# EAGLE design main (EAGLE 9.6.2)
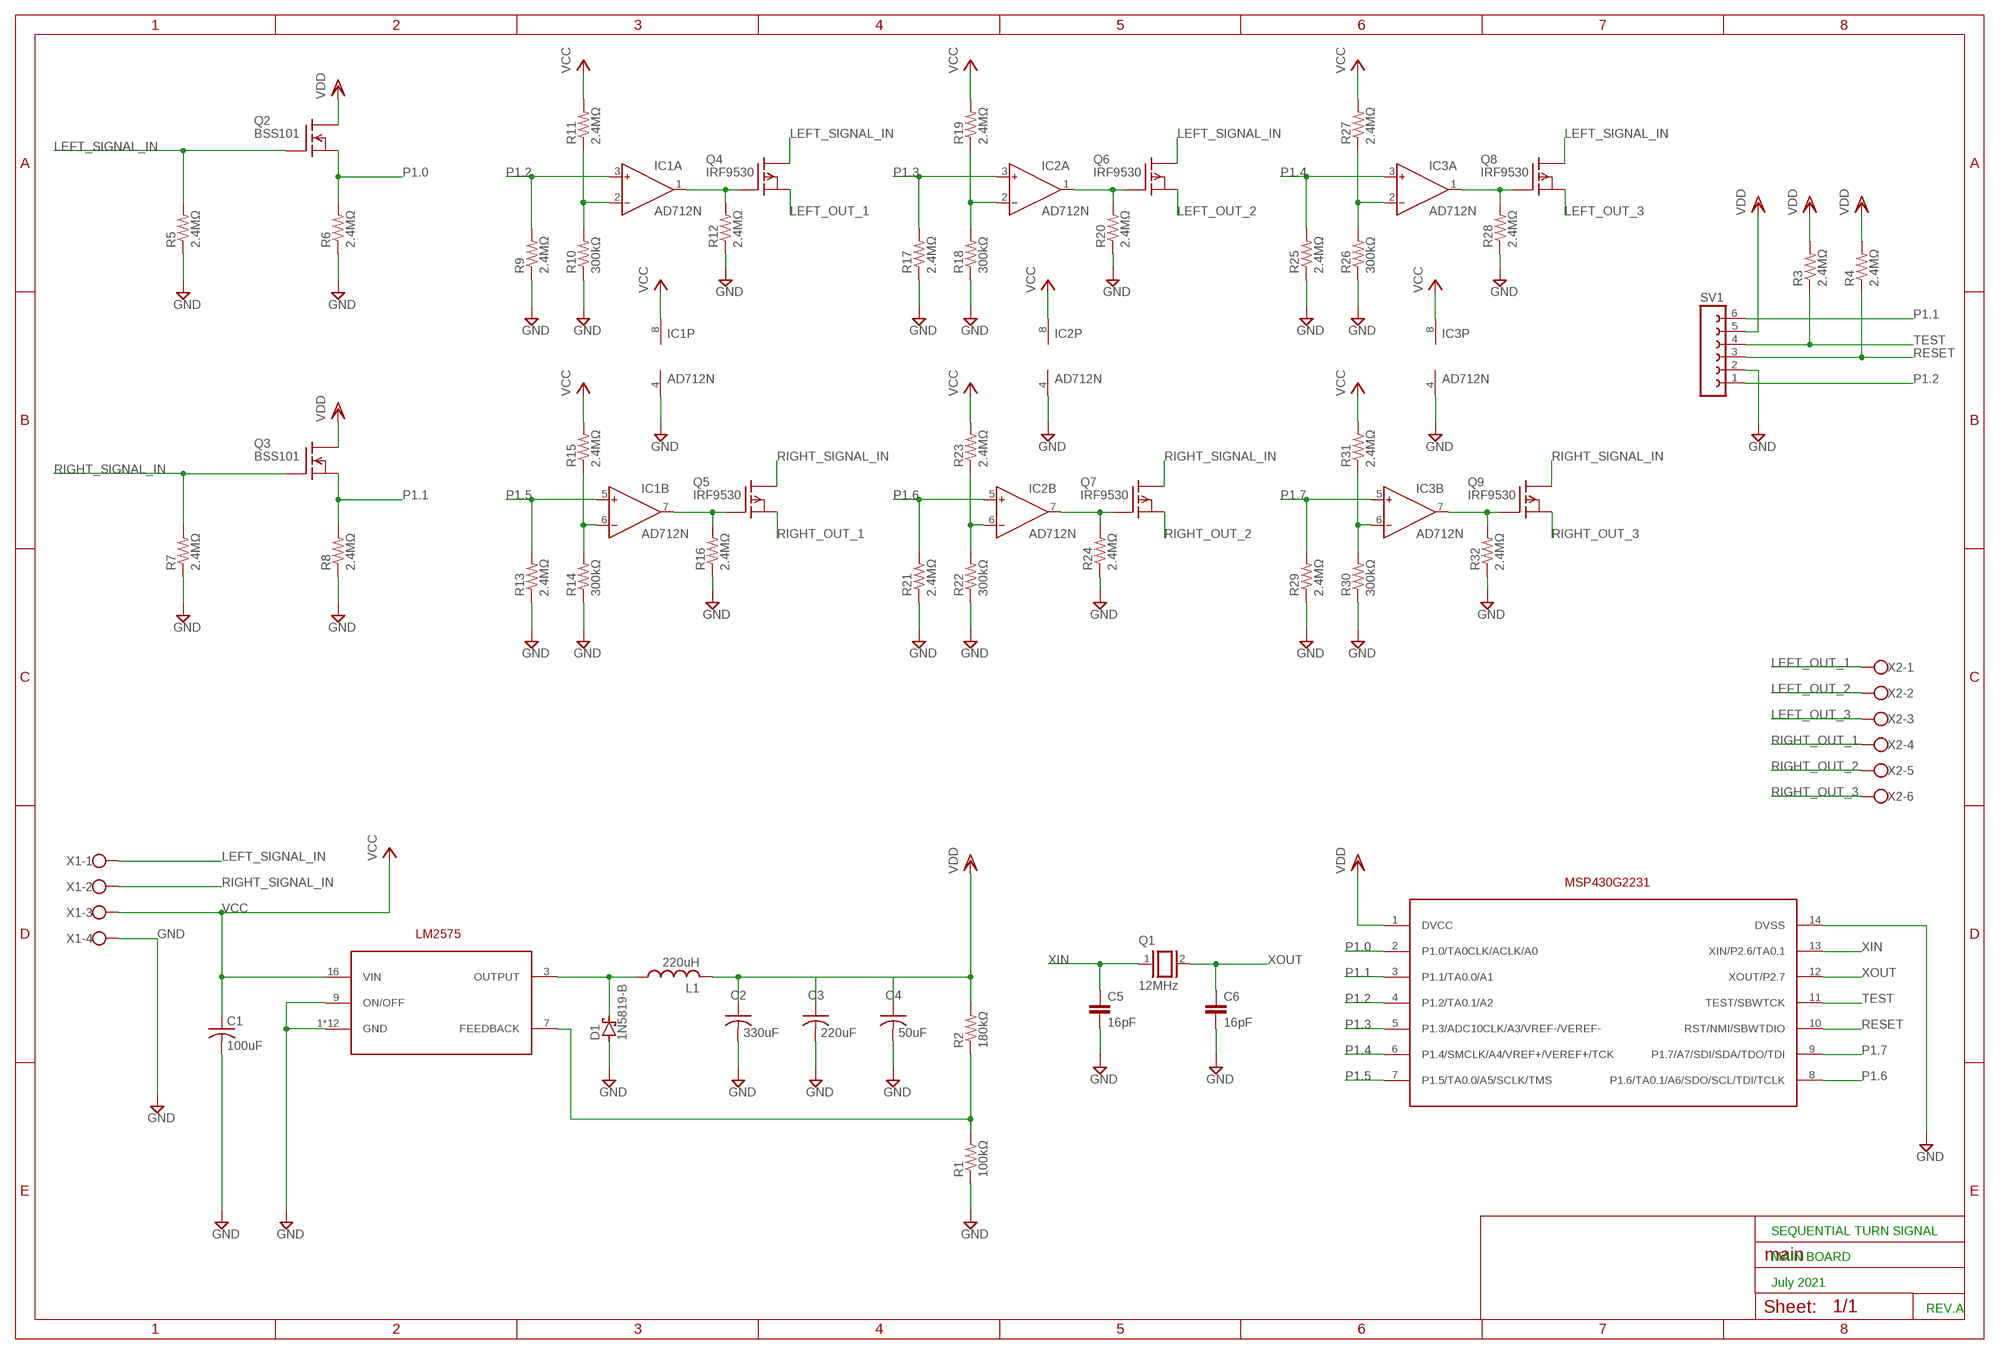
[diagram p0: schematic, sheet 1]

## Parts
C1  100uF  C-US025-050X050  [C025-050X050]
C2  330uF  C-US025-050X050  [C025-050X050]
C3  220uF  C-US025-050X050  [C025-050X050]
C4  50uF  C-US025-050X050  [C025-050X050]
C5  16pF  C-EU025-024X044  [C025-024X044]
C6  16pF  C-EU025-024X044  [C025-024X044]
D1  1N5819-B  [DO41-7.6]
IC1  AD712N  [DIL08]
IC2  AD712N  [DIL08]
IC3  AD712N  [DIL08]
L1  220uH  L-US6000-XXX-RC  [6000-XXXX-RC]
Q1  12MHz  XTAL  [Q]
Q2  BSS101  [TO92]
Q3  BSS101  [TO92]
Q4  IRF9530  [TO220]
Q5  IRF9530  [TO220]
Q6  IRF9530  [TO220]
Q7  IRF9530  [TO220]
Q8  IRF9530  [TO220]
Q9  IRF9530  [TO220]
R1  100kΩ  R-US_0207/12  [0207/12]
R2  180kΩ  R-US_0207/12  [0207/12]
R3  2.4MΩ  R-US_0207/12  [0207/12]
R4  2.4MΩ  R-US_0207/12  [0207/12]
R5  2.4MΩ  R-US_0207/12  [0207/12]
R6  2.4MΩ  R-US_0207/12  [0207/12]
R7  2.4MΩ  R-US_0207/12  [0207/12]
R8  2.4MΩ  R-US_0207/12  [0207/12]
R9  2.4MΩ  R-US_0207/12  [0207/12]
R10  300kΩ  R-US_0207/12  [0207/12]
R11  2.4MΩ  R-US_0207/12  [0207/12]
R12  2.4MΩ  R-US_0207/12  [0207/12]
R13  2.4MΩ  R-US_0207/12  [0207/12]
R14  300kΩ  R-US_0207/12  [0207/12]
R15  2.4MΩ  R-US_0207/12  [0207/12]
R16  2.4MΩ  R-US_0207/12  [0207/12]
R17  2.4MΩ  R-US_0207/12  [0207/12]
R18  300kΩ  R-US_0207/12  [0207/12]
R19  2.4MΩ  R-US_0207/12  [0207/12]
R20  2.4MΩ  R-US_0207/12  [0207/12]
R21  2.4MΩ  R-US_0207/12  [0207/12]
R22  300kΩ  R-US_0207/12  [0207/12]
R23  2.4MΩ  R-US_0207/12  [0207/12]
R24  2.4MΩ  R-US_0207/12  [0207/12]
R25  2.4MΩ  R-US_0207/12  [0207/12]
R26  300kΩ  R-US_0207/12  [0207/12]
R27  2.4MΩ  R-US_0207/12  [0207/12]
R28  2.4MΩ  R-US_0207/12  [0207/12]
R29  2.4MΩ  R-US_0207/12  [0207/12]
R30  300kΩ  R-US_0207/12  [0207/12]
R31  2.4MΩ  R-US_0207/12  [0207/12]
R32  2.4MΩ  R-US_0207/12  [0207/12]
SV1  FE06-1  [FE06]
U$1  MSP430G2231PDIP14  [DIP762W53P254L1969H508Q14B]
U$2  LM2575PDIP16  [DIP762W53P254L1969H508Q16B]
X1  W237-4  [W237-4]
X2  W237-6  [W237-6]

## Nets
GND: C1.2 C2.2 C3.2 C4.2 C5.2 C6.2 D1.A IC1.4(P:V-) IC2.4(P:V-) IC3.4(P:V-) R1.1 R5.1 R6.1 R7.1 R8.1 R9.1 R10.1 R12.1 R13.1 R14.1 R16.1 R17.1 R18.1 R20.1 R21.1 R22.1 R24.1 R25.1 R26.1 R28.1 R29.1 R30.1 R32.1 SV1.2 U$1.14(DVSS) U$2.1(GND) U$2.2(GND) U$2.4(GND) U$2.5(GND) U$2.6(GND) U$2.8(GND) U$2.9(ON/OFF) U$2.10(GND) U$2.11(GND) U$2.12(GND) U$2.13(GND) U$2.14(GND) U$2.15(GND) X1.4
LEFT_OUT_1: Q4.3(S) X2.1
LEFT_OUT_2: Q6.3(S) X2.2
LEFT_OUT_3: Q8.3(S) X2.3
LEFT_SIGNAL_IN: Q2.2(G) Q4.2(D) Q6.2(D) Q8.2(D) R5.2 X1.1
N$1: D1.C L1.1 U$2.3(OUTPUT)
N$3: R1.2 R2.1 U$2.7(FEEDBACK)
N$8: IC1.6(B:IN-) R14.2 R15.1
N$10: IC1.7(B:OUT) Q5.1(G) R16.2
N$11: IC1.1(A:OUT) Q4.1(G) R12.2
N$14: IC1.2(A:IN-) R10.2 R11.1
N$18: IC2.6(B:IN-) R22.2 R23.1
N$20: IC2.7(B:OUT) Q7.1(G) R24.2
N$21: IC2.1(A:OUT) Q6.1(G) R20.2
N$24: IC2.2(A:IN-) R18.2 R19.1
N$28: IC3.6(B:IN-) R30.2 R31.1
N$30: IC3.7(B:OUT) Q9.1(G) R32.2
N$31: IC3.1(A:OUT) Q8.1(G) R28.2
N$34: IC3.2(A:IN-) R26.2 R27.1
P1.0: Q2.1(S) R6.2 U$1.2(P1.0/TA0CLK/ACLK/A0)
P1.1: Q3.1(S) R8.2 SV1.6 U$1.3(P1.1/TA0.0/A1)
P1.2: IC1.3(A:IN+) R9.2 SV1.1 U$1.4(P1.2/TA0.1/A2)
P1.3: IC2.3(A:IN+) R17.2 U$1.5(P1.3/ADC10CLK/A3/VREF-/VEREF-)
P1.4: IC3.3(A:IN+) R25.2 U$1.6(P1.4/SMCLK/A4/VREF+/VEREF+/TCK)
P1.5: IC1.5(B:IN+) R13.2 U$1.7(P1.5/TA0.0/A5/SCLK/TMS)
P1.6: IC2.5(B:IN+) R21.2 U$1.8(P1.6/TA0.1/A6/SDO/SCL/TDI/TCLK)
P1.7: IC3.5(B:IN+) R29.2 U$1.9(P1.7/A7/SDI/SDA/TDO/TDI)
RESET: R4.1 SV1.3 U$1.10(RST/NMI/SBWTDIO)
RIGHT_OUT_1: Q5.3(S) X2.4
RIGHT_OUT_2: Q7.3(S) X2.5
RIGHT_OUT_3: Q9.3(S) X2.6
RIGHT_SIGNAL_IN: Q3.2(G) Q5.2(D) Q7.2(D) Q9.2(D) R7.2 X1.2
TEST: R3.1 SV1.4 U$1.11(TEST/SBWTCK)
VCC: C1.1 IC1.8(P:V+) IC2.8(P:V+) IC3.8(P:V+) R11.2 R15.2 R19.2 R23.2 R27.2 R31.2 U$2.16(VIN) X1.3
VDD: C2.1 L1.2 Q2.3(D) Q3.3(D) R2.2 R3.2 R4.2 SV1.5 U$1.1(DVCC)
VDD1: C3.1
VDD2: C4.1
XIN: C5.1 Q1.1 U$1.13(XIN/P2.6/TA0.1)
XOUT: C6.1 Q1.2 U$1.12(XOUT/P2.7)

## Notes on the sheet
- SEQUENTIAL TURN SIGNAL
- MAIN BOARD
- July 2021
- REV.A

## Library data of the parts
C1-C4 = rcl:C-US: CAPACITOR, American symbol; SPICEPREFIX: C
C5 C6 = rcl:C-EU: CAPACITOR, European symbol; SPICEPREFIX: C
D1 = diode:1N581*: 1.0A SCHOTTKY BARRIER RECTIFIER Source: http://www.diodes.com/datasheets/ds23001.pdf
IC1-IC3 = analog-devices:AD712: Dual Precision, Low Cost, High Speed BiFET Op Amp Source: http://www.analog.com/static/imported-files/data_sheets/AD712.pdf; MF: ALTERA CORPORATION; MPN: AD712JNZ; OC_FARNELL: 9604898; OC_NEWARK: 59K4554
L1 = rcl:L-US: INDUCTOR, American symbol; SPICEPREFIX: L
Q1 = special:XTAL: CRYSTAL
Q2 Q3 = transistor-fet:BSS101: N-Channel Enhancement MOSFET 200V; 0,16A; 11Ohm
Q4-Q9 = transistor-fet:IRF9530: P-Channel Enhancement MOSFET (HEXFET); -100V; -12A; 0,3Ohm
R1-R32 = rcl:R-US_: RESISTOR, American symbol; SPICEPREFIX: R
SV1 = con-lsta:FE06-1: FEMALE HEADER; OC_FARNELL: unknown; OC_NEWARK: unknown
U$1 = sequential_turn_signal:MSP430G2231: The Texas Instruments MSP430 family of ultra-low-power microcontrollers consists of several devices featuring different sets of peripherals targeted for various applications. The architecture, combined with five low-power modes, is optimized to achieve extended battery life in portable measurement applications. The device features a powerful 16-bit RISC CPU, 16-bit registers, and constant generators that contribute to maximum code efficiency. The digitally controlled oscillator (DCO) allows wake-up from low-power modes to active mode in less than 1 µs. The MSP430G2x21/G2x31 series is an ultra-low-power mixed signal microcontroller with a built-in 16-bit timer and ten I/O pins. The MSP430G2x31 family members have a 10-bit A/D converter and built-in communication capability using synchronous protocols (SPI or I2C). Typical applications include low-cost sensor systems that capture analog signals, convert them to digital values, and then process the data for display or for transmission to a host system.
U$2 = sequential_turn_signal:LM2575: The LM2575 device greatly simplifies the design of switching power supplies by conveniently providing all the active functions needed for a step-down (buck) switching regulator in an integrated circuit. Accepting a wide input voltage range and available in an adjustable output version, the LM2575 has an integrated switch capable of delivering 1 A of load current, with excellent line and load regulation. The device also offers internal frequency compensation, a fixed-frequency oscillator, cycle-by-cycle current limiting, and thermal shutdown. In addition, a manual shutdown is available through an external ON/OFF pin. The LM2575 represents a superior alternative to popular three-terminal linear regulators. Due to its high efficiency, it significantly reduces the size of the heat sink and, in many cases, no heat sink is required. Optimized for use with standard series of inductors available from several different manufacturers, the LM2575 greatly simplifies the design of switch-mode power supplies by requiring a minimal addition of only four to six external components for operation. The LM2575 is characterized for operation over the virtual junction temperature range of –40°C to 125°C.
X1 = con-wago-500:W237-4: WAGO SCREW CLAMP; OC_FARNELL: unknown; OC_NEWARK: unknown
X2 = con-wago-500:W237-6: WAGO SCREW CLAMP; OC_FARNELL: unknown; OC_NEWARK: unknown

## Board
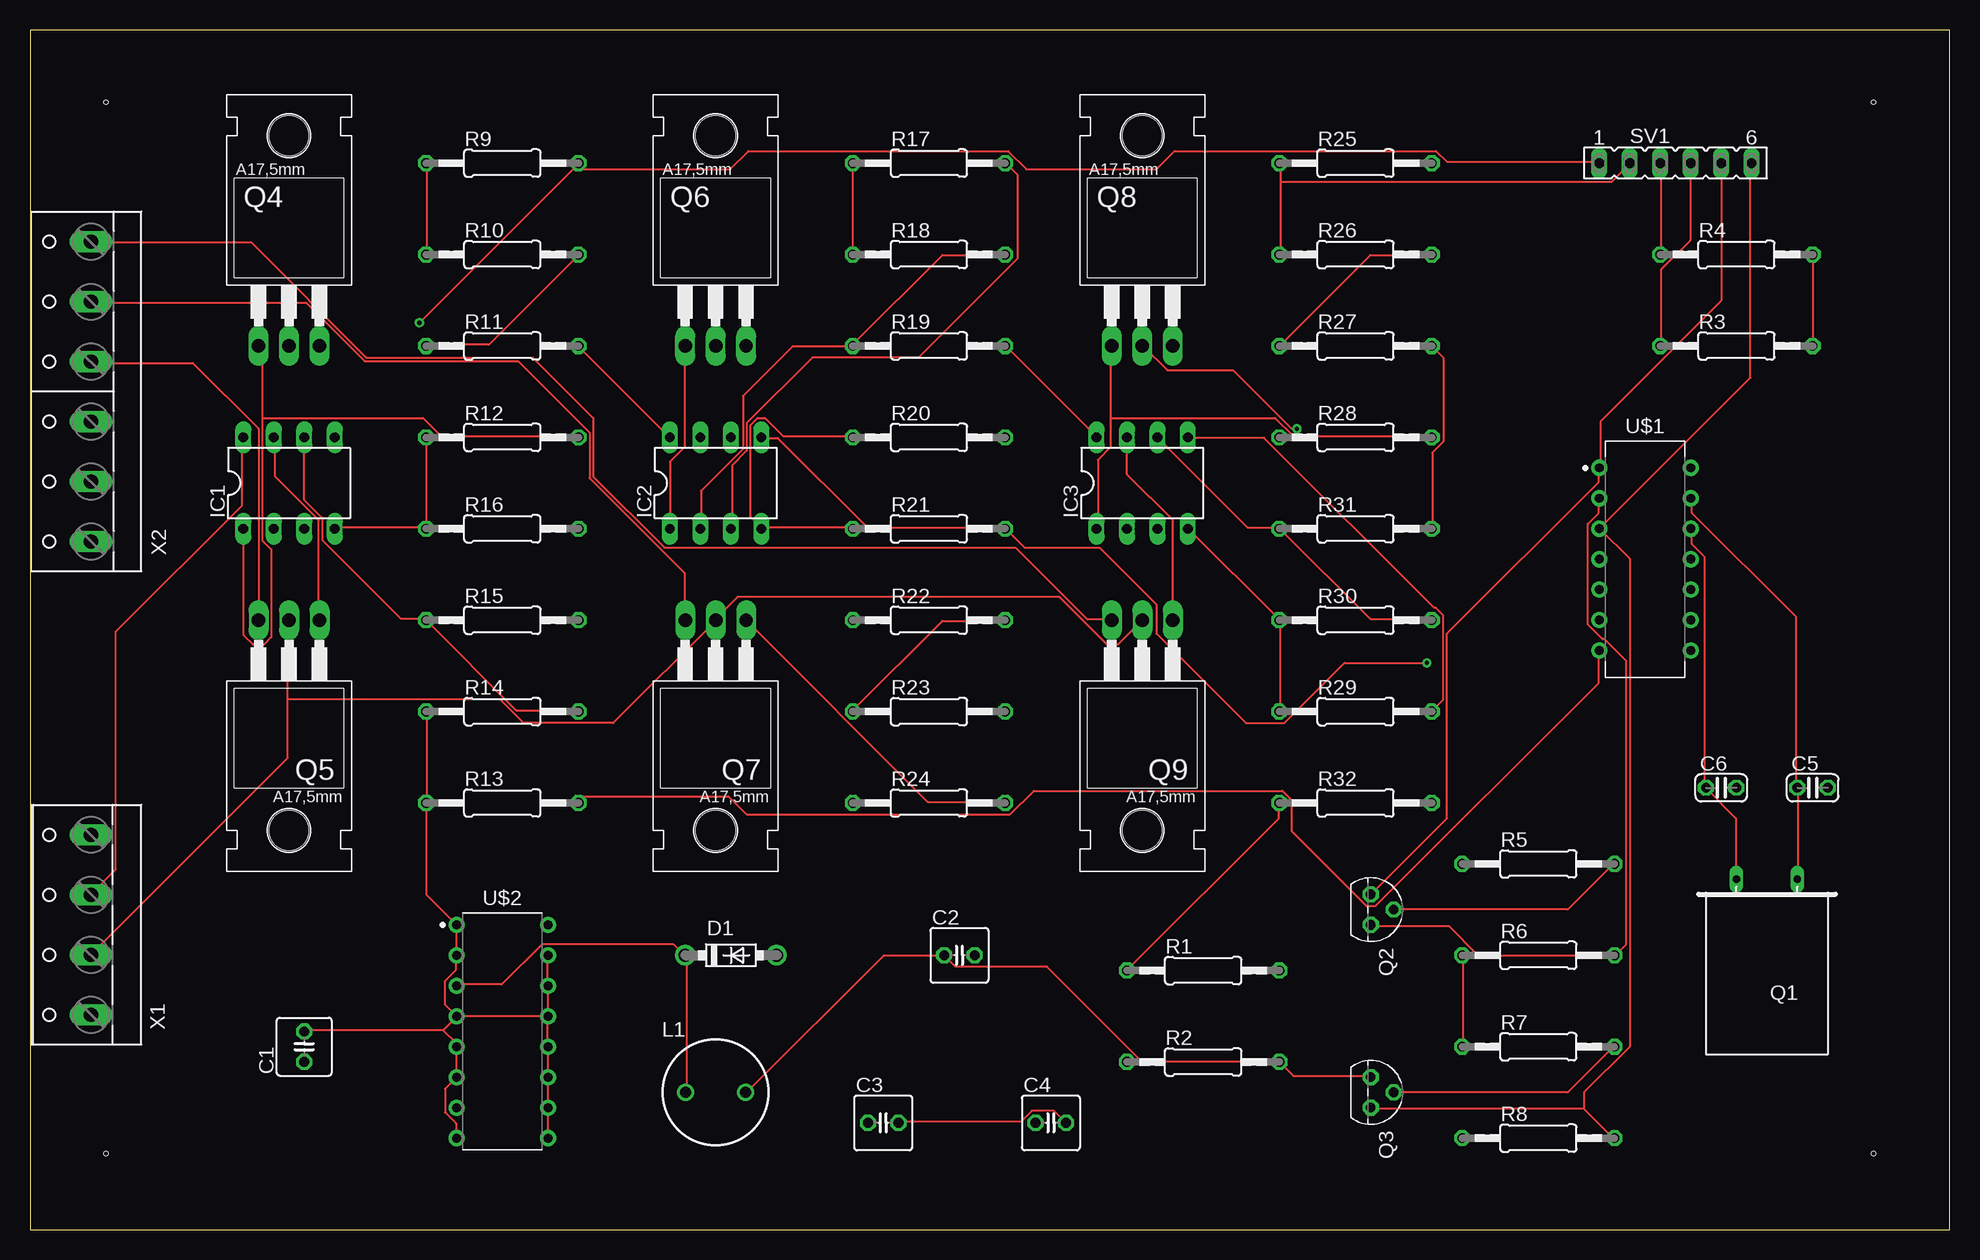
[diagram p1: board, top side]
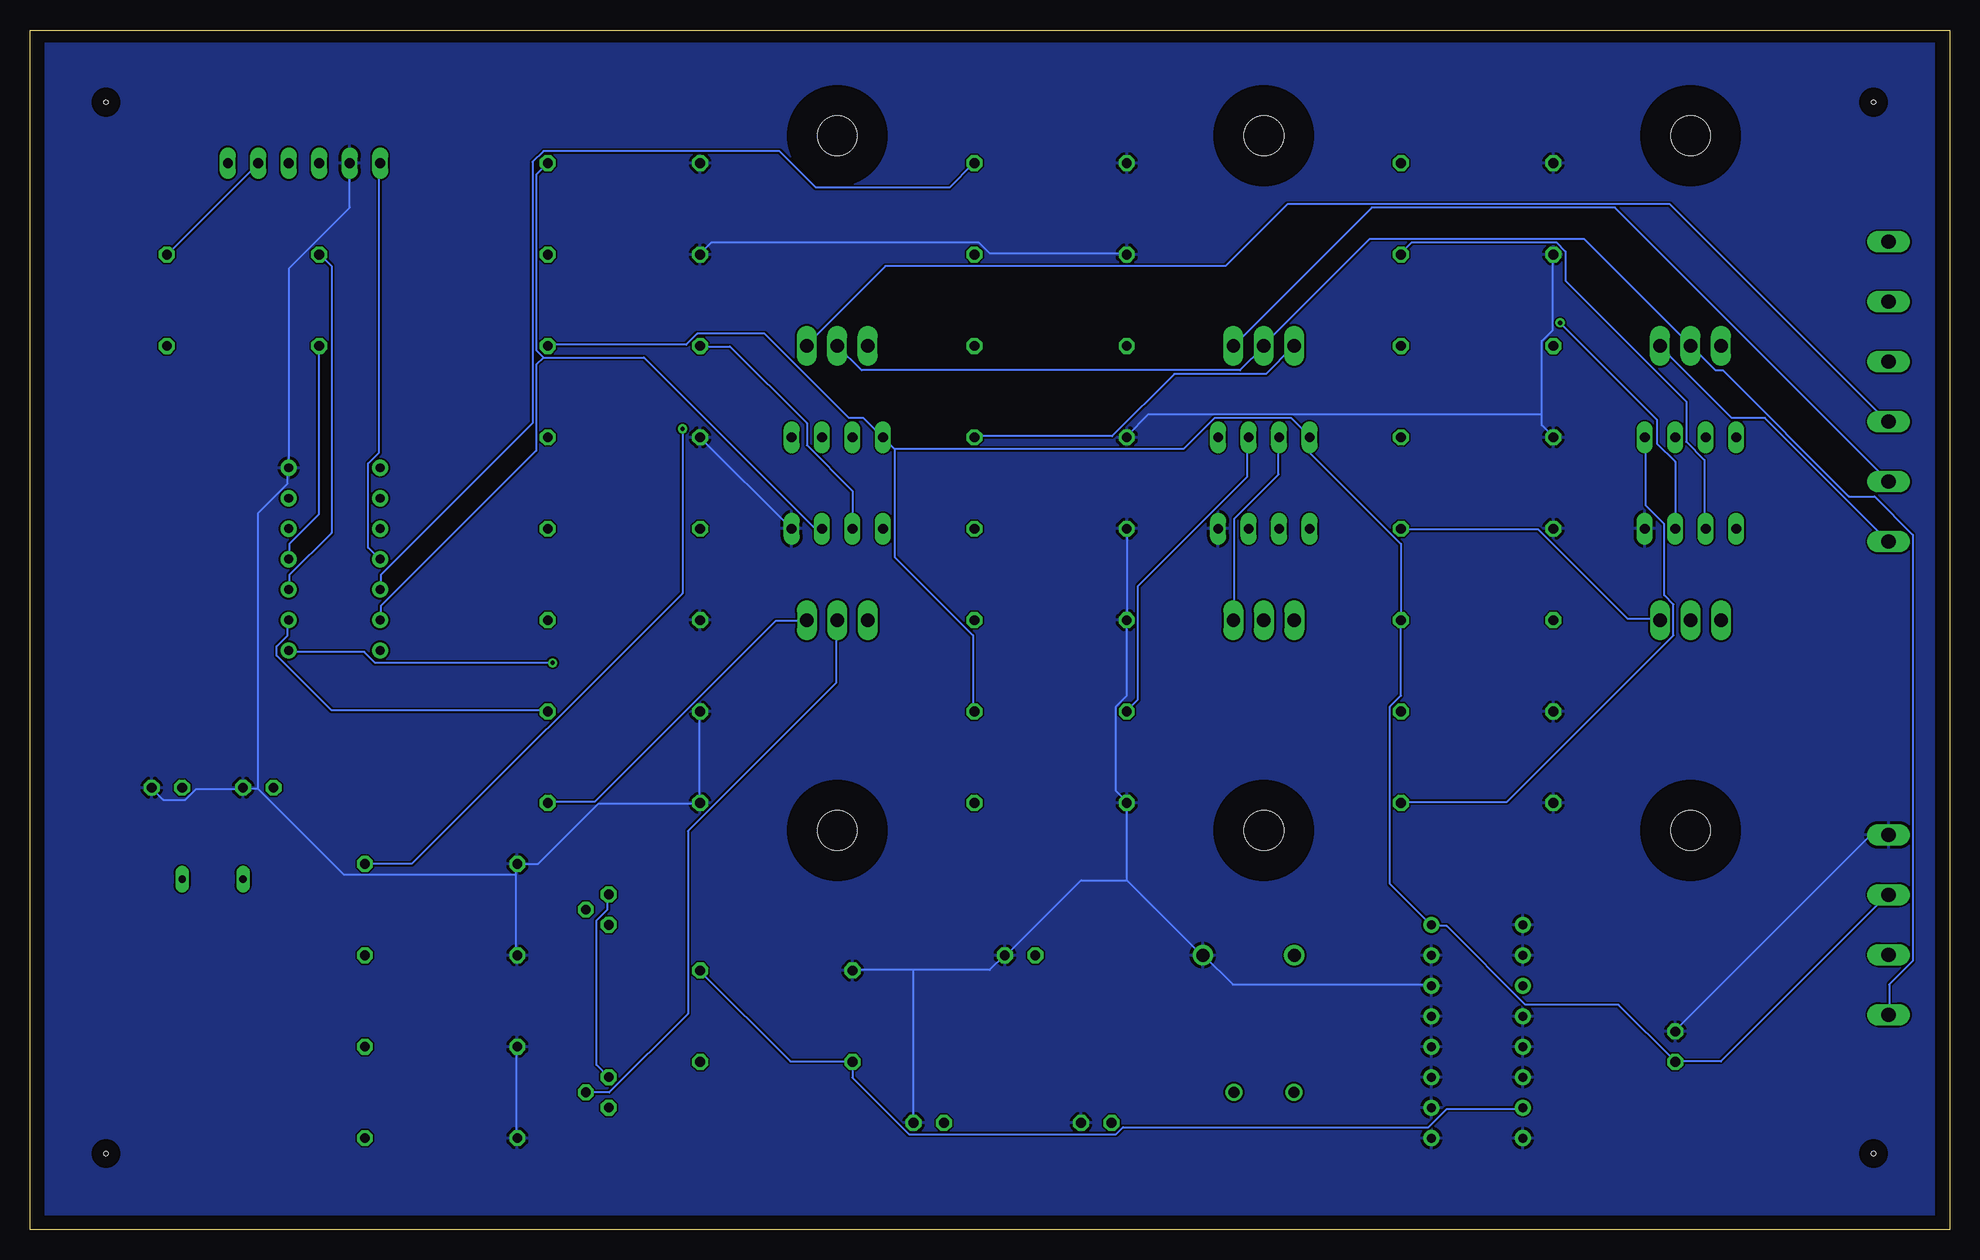
[diagram p2: board, bottom side, seen from below]

Size 160 x 100 mm. Coordinates in mm from the lower left corner, seen from the top.
Outline: 0,0 160,0 160,100 0,100 0,0
Copper layers (1*16): Top 0.035mm / dielectric 1.5mm / Bottom 0.035mm
Design rules "default": minimum track width 6mil, minimum drill 0.35mm, track to track 6mil, track to pad 6mil, pad to pad 6mil, via to via 6mil, smd to smd 6mil, copper to edge 40mil, drill to drill 6mil, minimum pad ring 10mil, minimum via ring 8mil, stop-mask expansion 4mil, vias tented up to drill 0mil, thermal gap 10mil
Holes 0.35 mm at 6.35,93.98 6.35,6.35 153.67,6.35 153.67,93.98

### Footprints (pad centres in the part's own frame; a part is rotated, then mirrored left to right if it is on the bottom)
C025-050X050 = drill 0.813 octagon: 1 -1.27,0; 2 1.27,0
C025-024X044 = drill 0.813 octagon: 1 -1.27,0; 2 1.27,0
DO41-7.6 = drill 1.1 pad 1.7: A 3.81,0; C -3.81,0
DIL08 = drill 0.813 long: 1 -3.81,-3.81; 2 -1.27,-3.81; 3 1.27,-3.81; 4 3.81,-3.81; 5 3.81,3.81; 6 1.27,3.81; 7 -1.27,3.81; 8 -3.81,3.81
6000-XXXX-RC = drill 0.9 pad 1.422: 1 -2.5,0; 2 2.5,0
Q = drill 0.61 long: 1 -2.54,-7.62; 2 2.54,-7.62
TO92 = drill 0.813 octagon: 1 1.27,0; 2 0,1.905; 3 -1.27,0
TO220 = drill 1.118 long: 1 -2.54,-6.35; 2 0,-6.35; 3 2.54,-6.35 | hole 3.302: 0,11.176
0207/12 = drill 0.813 octagon: 1 -6.35,0; 2 6.35,0
FE06 = drill 0.813 long: 1 -6.35,0; 2 -3.81,0; 3 -1.27,0; 4 1.27,0; 5 3.81,0; 6 6.35,0
DIP762W53P254L1969H508Q14B = drill 0.743 pad 1.343: 1 -3.81,7.62; 2 -3.81,5.08; 3 -3.81,2.54; 4 -3.81,0; 5 -3.81,-2.54; 6 -3.81,-5.08; 7 -3.81,-7.62; 8 3.81,-7.62; 9 3.81,-5.08; 10 3.81,-2.54; 11 3.81,0; 12 3.81,2.54; 13 3.81,5.08; 14 3.81,7.62
DIP762W53P254L1969H508Q16B = drill 0.743 pad 1.343: 1 -3.81,8.89; 2 -3.81,6.35; 3 -3.81,3.81; 4 -3.81,1.27; 5 -3.81,-1.27; 6 -3.81,-3.81; 7 -3.81,-6.35; 8 -3.81,-8.89; 9 3.81,-8.89; 10 3.81,-6.35; 11 3.81,-3.81; 12 3.81,-1.27; 13 3.81,1.27; 14 3.81,3.81; 15 3.81,6.35; 16 3.81,8.89
W237-4 = drill 1.194 long: 1 -7.5,-1.27; 2 -2.5,-1.27; 3 2.5,-1.27; 4 7.5,-1.27
W237-6 = drill 1.194 long: 1 -12.5,-1.27; 2 -7.5,-1.27; 3 -2.5,-1.27; 4 2.5,-1.27; 5 7.5,-1.27; 6 12.5,-1.27

### Placement (x,y rotation side)
C1  22.86,15.24 90 top
C2  77.47,22.86 0 top
C3  71.12,8.89 0 top
C4  85.09,8.89 0 top
C5  148.59,36.83 0 top
C6  140.97,36.83 0 top
D1  58.42,22.86 0 top
IC1  21.59,62.23 0 top
IC2  57.15,62.23 0 top
IC3  92.71,62.23 0 top
L1  57.15,11.43 0 top
Q1  144.78,21.59 180 top
Q2  111.76,26.67 270 top
Q3  111.76,11.43 270 top
Q4  21.59,80.01 0 top
Q5  21.59,44.45 180 top
Q6  57.15,80.01 0 top
Q7  57.15,44.45 180 top
Q8  92.71,80.01 0 top
Q9  92.71,44.45 180 top
R1  97.79,21.59 0 top
R2  97.79,13.97 0 top
R3  142.24,73.66 0 top
R4  142.24,81.28 0 top
R5  125.73,30.48 0 top
R6  125.73,22.86 0 top
R7  125.73,15.24 0 top
R8  125.73,7.62 0 top
R9  39.37,88.9 0 top
R10  39.37,81.28 0 top
R11  39.37,73.66 0 top
R12  39.37,66.04 0 top
R13  39.37,35.56 0 top
R14  39.37,43.18 0 top
R15  39.37,50.8 0 top
R16  39.37,58.42 0 top
R17  74.93,88.9 0 top
R18  74.93,81.28 0 top
R19  74.93,73.66 0 top
R20  74.93,66.04 0 top
R21  74.93,58.42 0 top
R22  74.93,50.8 0 top
R23  74.93,43.18 0 top
R24  74.93,35.56 0 top
R25  110.49,88.9 0 top
R26  110.49,81.28 0 top
R27  110.49,73.66 0 top
R28  110.49,66.04 0 top
R29  110.49,43.18 0 top
R30  110.49,50.8 0 top
R31  110.49,58.42 0 top
R32  110.49,35.56 0 top
SV1  137.16,88.9 0 top
U$1  134.62,55.88 0 top
U$2  39.37,16.51 0 top
X1  3.81,25.4 90 top
X2  3.81,69.85 90 top

### Tracks (layer width: path | path; a pad name or v marks a point on that pad's centre or on a via)
GND
  Top 0.152: R17.1 R18.1 | 104.24,87.33 104.24,88.85 R25.1 | 104.24,87.33 104.24,81.38 R26.1 | R29.1 104.24,43.28 104.24,50.75 R30.1 104.09,50.9 96.62,58.37 IC3.4 | R6.1 119.48,22.86 119.48,15.24 R7.1 | 104.24,87.33 131.83,87.33 133.35,88.85 SV1.2 | 43.13,17.83 43.13,20.27 U$2.14 43.13,20.42 43.13,22.86 U$2.15 | U$2.9 43.13,7.62 43.13,10.06 U$2.10 43.13,10.21 43.13,12.65 U$2.11 43.13,12.8 43.13,15.24 | 43.13,15.24 43.13,17.68 U$2.13 43.13,17.83 | 43.13,15.24 U$2.12 | R14.1 33.07,43.13 33.07,35.66 R13.1 33.07,35.51 33.07,27.89 U$2.1 35.51,25.3 35.51,22.86 | U$2.8 35.51,7.62 35.51,8.84 34.59,9.75 34.59,11.73 U$2.6 35.51,12.8 35.51,15.24 | 34.44,16.61 22.86,16.61 C1.2 | 34.44,16.61 35.51,17.68 U$2.4 | 35.51,15.24 35.51,15.54 34.44,16.61 | 35.51,22.86 35.51,21.64 34.59,20.73 34.59,18.75 U$2.4 | 35.51,22.86 U$2.2 | 35.51,15.24 U$2.5 | 43.13,17.83 35.66,17.83 U$2.4 | R10.1 33.07,81.38 33.07,88.85 R9.1 | IC1.4 25.45,58.52 32.92,58.52 R16.1 33.07,58.52 33.07,65.99 R12.1 | 60.96,58.52 68.58,58.52 R21.1 | 60.96,58.52 60.05,59.44 60.05,67.06 60.66,67.67 61.27,67.67 62.79,66.14 68.58,66.14 R20.1 | 60.96,58.52 IC2.4 | C4.2 85.34,9.91 83.52,9.91 82.6,8.99 72.39,8.99 C3.2 | R32.1 104.09,35.51 104.09,34.29 91.44,21.64 R1.1
  Bottom 0.152: R18.1 68.58,81.38 80.01,81.38 80.92,82.3 103.17,82.3 104.09,81.38 R26.1 | R28.1 IC3.4 | R29.1 104.24,43.13 104.24,35.66 R32.1 104.24,35.51 112.62,35.51 117.65,30.48 R5.1 119.48,30.48 119.48,29.57 | SV1.2 133.35,85.19 138.38,80.16 138.38,63.55 U$1.14 138.53,63.4 138.53,62.18 140.97,59.74 140.97,36.73 | C5.2 149.81,36.73 148.9,35.81 147.07,35.81 146.15,36.73 142.34,36.73 C6.2 142.19,36.73 140.97,36.73 | R8.1 119.48,7.62 119.48,15.24 R7.1 | 119.48,29.57 119.48,22.86 R6.1 | 140.97,36.73 133.81,29.57 119.48,29.57 | X1.4 5.18,32.77 6.71,32.77 22.86,16.61 C1.2 | 33.98,67.97 33.98,67.06 33.07,66.14 R12.1 | 33.98,67.97 33.98,74.07 33.07,74.98 33.07,81.23 R10.1 | R21.1 R22.1 68.58,44.5 69.49,43.59 69.49,36.58 68.58,35.66 R24.1 68.58,29.11 | 68.58,29.11 62.33,22.86 D1.A 62.18,22.86 59.74,20.42 43.28,20.42 U$2.14 | 86.41,21.64 80.01,21.64 78.79,22.86 C2.2 78.64,22.86 72.39,29.11 68.58,29.11 | 86.41,21.64 91.44,21.64 R1.1 | 86.41,21.64 86.41,8.99 C4.2 | 33.98,67.97 66.75,67.97 68.58,66.14 R20.1
  pour Bottom: 1.27,99.06 158.75,99.06 158.75,1.27 1.27,1.27
LEFT_OUT_1
  Bottom 0.152: Q4.3 18.14,67.67 15.39,67.67 5.18,57.45 X2.1
LEFT_OUT_2
  Bottom 0.152: Q6.3 48.16,85.19 27.89,85.19 5.18,62.48 X2.2
LEFT_OUT_3
  Bottom 0.152: Q8.3 95.25,73.76 88.7,80.31 60.35,80.31 55.17,85.5 23.32,85.5 5.18,67.36 X2.3
LEFT_SIGNAL_IN  (via drill 0.35)
  Top 0.152: Q2.2 128.17,26.67 131.98,30.48 R5.2 | v105.61,66.75 105.16,66.75 100.28,71.63 94.79,71.63 92.81,73.61 Q8.2
  Bottom 0.152: Q8.2 90.68,71.63 59.13,71.63 57.15,73.61 Q6.2 57.15,73.76 48.31,82.6 30.48,82.6 21.64,73.76 Q4.2 21.49,73.61 19.51,71.63 18.9,71.63 8.38,61.11 6.25,61.11 3.05,57.91 3.05,22.4 5.03,20.42 5.03,17.98 X1.1 | R5.2 128.17,30.48 105.61,53.03 v105.61,66.75
N$1
  Top 0.152: U$2.3 35.66,20.42 39.32,20.42 42.67,23.77 53.65,23.77 54.56,22.86 D1.C 54.71,22.86 54.71,11.43 L1.1
N$3
  Bottom 0.152: R1.2 104.09,21.49 96.62,14.02 91.44,14.02 R2.1 91.44,12.65 86.72,7.92 69.49,7.92 68.89,8.53 43.43,8.53 41.91,10.06 35.66,10.06 U$2.7
N$8
  Top 0.152: R14.2 45.72,43.28 40.54,43.28 R15.1 32.92,50.9 30.94,50.9 24.38,57.45 24.38,59.28 22.86,60.81 IC1.6
N$10
  Top 0.152: IC1.7 20.42,65.99 20.42,62.79 24.08,59.13 24.08,50.9 Q5.1
  Bottom 0.152: R16.2 45.72,58.37 34.29,58.37 26.82,50.9 24.23,50.9 Q5.1
N$11
  Top 0.152: 19.36,67.67 19.36,73.3 19.05,73.61 Q4.1 | 19.36,67.67 19.36,57.45 20.12,56.69 20.12,49.38 19.51,48.77 18.59,48.77 17.83,49.53 17.83,58.37 IC1.1 | 19.36,67.67 32.77,67.67 34.29,66.14 45.72,66.14 R12.2
N$14
  Top 0.152: R11.1 33.07,73.76 38.25,73.76 45.72,81.23 R10.2
  Bottom 0.152: IC1.2 20.42,58.52 20.42,64.16 21.95,65.68 21.95,69.04 32,79.1 32,81.53 32.77,82.3 44.81,82.3 45.72,81.38 R10.2
N$18
  Top 0.152: R22.2 81.23,50.75 76.05,50.75 68.58,43.28 R23.1
  Bottom 0.152: IC2.6 58.52,65.99 58.52,62.79 67.67,53.65 67.67,44.2 68.58,43.28 R23.1
N$20
  Top 0.152: Q7.1 74.83,35.66 81.23,35.66 R24.2
  Bottom 0.152: IC2.7 55.93,65.99 55.93,62.94 59.59,59.28 59.59,50.9 Q7.1
N$21
  Top 0.152: IC2.1 53.34,64.01 54.56,65.23 54.56,73.61 Q6.1
  Bottom 0.152: R20.2 81.23,66.14 69.8,66.14 64.62,71.32 57,71.32 54.71,73.61 Q6.1
N$24
  Top 0.152: IC2.2 55.93,58.52 55.93,61.57 59.44,65.08 59.44,69.49 63.55,73.61 68.58,73.61 R19.1 68.58,73.76 76.05,81.23 81.23,81.23 R18.2
N$28
  Top 0.152: IC3.6 101.5,58.52 104.09,58.52 R31.1 104.24,58.37 111.71,50.9 116.74,50.9 R30.2
N$30
  Top 0.152: IC3.7 91.44,62.94 95.25,59.13 Q9.1
  Bottom 0.152: R32.2 116.74,35.66 112.93,35.66 97.84,50.75 95.25,50.75 Q9.1
N$31
  Top 0.152: 90.07,67.67 90.07,73.61 Q8.1 | 90.07,67.67 90.07,65.23 89,64.16 89,58.52 IC3.1 | 90.07,67.67 103.78,67.67 105.31,66.14 116.74,66.14 R28.2
N$34
  Top 0.152: R27.1 111.71,81.23 116.74,81.23 R26.2
  Bottom 0.152: IC3.2 91.44,61.57 95.25,65.38 95.25,67.21 101.65,73.61 104.09,73.61 R27.1
P1.0
  Top 0.152: Q2.1 111.86,25.3 118.26,25.3 120.7,22.86 R6.2 132.13,22.86 133.04,23.77 133.04,47.4 131.22,49.23 131.06,49.23 129.84,50.44 129.84,58.83 130.76,59.74 130.76,60.96 U$1.2
P1.1
  Top 0.152: 129.54,10.06 111.86,10.06 Q3.1 | 129.54,10.06 131.98,7.62 R8.2 | SV1.6 143.41,88.85 143.41,71.02 U$1.3 130.91,58.37 133.35,55.93 133.35,15.24 129.54,11.43 129.54,10.06
P1.2  (via drill 0.35)
  Top 0.152: 45.72,88.85 v32.46,75.59 | 45.72,88.85 46.18,88.39 58.37,88.39 59.89,89.92 81.53,89.92 83.06,88.39 93.88,88.39 95.4,89.92 117.2,89.92 118.11,89 130.76,89 SV1.1 | 45.72,88.85 R9.2
  Bottom 0.152: SV1.1 130.91,88.85 130.91,64.77 131.83,63.86 131.83,56.84 130.91,55.93 U$1.4 | IC1.3 22.86,64.01 24.38,65.53 24.38,67.51 v32.46,75.59
P1.3
  Top 0.152: IC2.3 58.52,58.52 58.52,63.7 59.74,64.92 59.74,67.21 65.23,72.69 74.07,72.69 82.3,80.92 82.3,87.94 81.38,88.85 R17.2
  Bottom 0.152: U$1.5 130.76,53.34 130.76,54.56 118.11,67.21 118.11,89 117.2,89.92 97.54,89.92 94.49,86.87 83.36,86.87 81.38,88.85 R17.2
P1.4
  Bottom 0.152: 117.2,72.69 108.81,72.69 94.64,58.52 94.03,58.52 IC3.3 | 117.2,72.69 117.81,73.3 117.81,87.94 R25.2 | 117.2,72.69 117.81,72.08 117.81,64.92 130.76,51.97 130.76,50.9 U$1.6
P1.5
  Top 0.152: U$1.7 130.76,48.16 130.76,45.57 112.17,26.98 111.4,26.98 105.16,33.22 105.16,35.81 104.39,36.58 83.67,36.58 81.69,34.59 59.74,34.59 58.22,36.12 46.18,36.12 45.72,35.66 R13.2
  Bottom 0.152: IC1.5 25.3,65.99 25.3,60.35 23.77,58.83 23.77,52.88 23.01,52.12 23.01,49.53 36.88,35.66 45.72,35.66 R13.2
P1.6  (via drill 0.35)
  Top 0.152: IC2.5 60.96,65.99 62.33,65.99 69.8,58.52 81.23,58.52 R21.2 81.38,58.37 82.91,56.84 89.15,56.84 93.88,52.12 93.88,49.68 101.35,42.22 104.55,42.22 109.58,47.24 v116.43,47.24
  Bottom 0.152: v116.43,47.24 131.22,47.24 132.13,48.16 138.38,48.16 U$1.8
P1.7
  Top 0.152: IC3.5 96.62,65.99 102.87,65.99 117.04,51.82 117.2,51.82 117.81,51.21 117.81,44.2 116.89,43.28 R29.2
  Bottom 0.152: U$1.9 138.53,50.75 138.53,49.53 139.45,48.62 139.45,47.85 134.87,43.28 116.89,43.28 R29.2
RESET
  Top 0.152: R4.1 135.94,81.38 135.94,88.85 SV1.3
  Bottom 0.152: U$1.10 138.38,53.34 138.38,54.56 134.87,58.06 134.87,80.31 135.79,81.23 R4.1
RIGHT_OUT_1
  Top 0.152: Q5.3 19.05,66.75 13.56,72.24 5.18,72.24 X2.4
RIGHT_OUT_2
  Top 0.152: Q7.3 54.56,50.9 54.56,54.71 46.63,62.64 46.63,66.45 40.69,72.39 27.89,72.39 23.01,77.27 5.18,77.27 X2.5
RIGHT_OUT_3
  Top 0.152: Q9.3 90.07,50.9 88.09,50.9 82.14,56.84 52.88,56.84 46.94,62.79 46.94,67.67 41.91,72.69 28.04,72.69 18.44,82.3 5.18,82.3 X2.6
RIGHT_SIGNAL_IN
  Top 0.152: 21.49,44.2 21.49,39.32 5.18,23.01 X1.2 | 21.49,44.2 21.49,50.75 Q5.2 | Q3.2 128.17,11.43 131.98,15.24 R7.2 | Q9.2 90.68,48.77 89.76,48.77 85.8,52.73 58.98,52.73 57.15,50.9 Q7.2 57.15,50.75 48.62,42.22 41.15,42.22 39.17,44.2 21.49,44.2
  Bottom 0.152: Q3.2 111.71,11.43 105.16,17.98 105.16,33.22 92.81,45.57 92.81,50.75 Q9.2
TEST
  Top 0.152: R3.1 135.94,73.76 135.94,80.01 138.38,82.45 138.38,88.85 SV1.4
  Bottom 0.152: U$1.11 138.38,55.93 138.38,57.15 135.94,59.59 135.94,73.61 R3.1
VCC
  Top 0.152: R27.2 117.81,72.69 117.81,65.68 116.89,64.77 116.89,58.52 R31.2 | R19.2 81.38,73.61 88.85,66.14 IC3.8 | R11.2 45.72,73.61 53.34,65.99 IC2.8 | IC1.8 17.68,65.99 17.68,60.35 7.16,49.84 7.16,30.02 5.18,28.04 X1.3
  Bottom 0.152: 87.94,65.08 87.94,56.08 81.38,49.53 81.38,43.28 R23.2 | 87.94,65.08 IC3.8 90.53,67.67 91.75,67.67 98.75,74.68 104.39,74.68 105.31,73.76 116.74,73.76 R27.2 | 22.86,14.02 19.05,14.02 5.18,27.89 X1.3 | 22.86,14.02 27.58,18.75 35.36,18.75 41.91,25.3 43.13,25.3 U$2.16 43.28,25.45 46.63,28.8 46.63,43.59 45.72,44.5 R15.2 45.72,57.15 53.34,64.77 IC2.8 53.34,66.14 54.86,67.67 61.27,67.67 63.86,65.08 87.94,65.08 | 22.86,14.02 C1.1
VDD
  Top 0.152: R4.2 R3.2 | SV1.5 140.97,77.42 130.91,67.36 130.91,63.55 U$1.1 130.76,63.4 130.76,62.33 118.11,49.68 118.11,34.29 Q2.3 | Q3.3 111.71,12.8 105.31,12.8 R2.2 104.09,14.02 92.66,14.02 84.73,21.95 77.11,21.95 C2.1 71.17,22.86 59.74,11.43 L1.2
  Bottom 0.152: SV1.5 140.97,88.85 148.59,81.23 R4.2 | Q3.3 112.78,13.72 112.78,25.76 111.86,26.67 111.86,27.89 Q2.3
XIN
  Top 0.152: Q1.1 147.37,29.26 147.37,36.73 C5.1 147.22,36.88 147.22,51.05 138.53,59.74 138.53,60.96 U$1.13
XOUT
  Top 0.152: Q1.2 142.19,29.26 142.19,34.29 139.75,36.73 C6.1 139.6,36.88 139.6,56.08 138.53,57.15 138.53,58.37 U$1.12